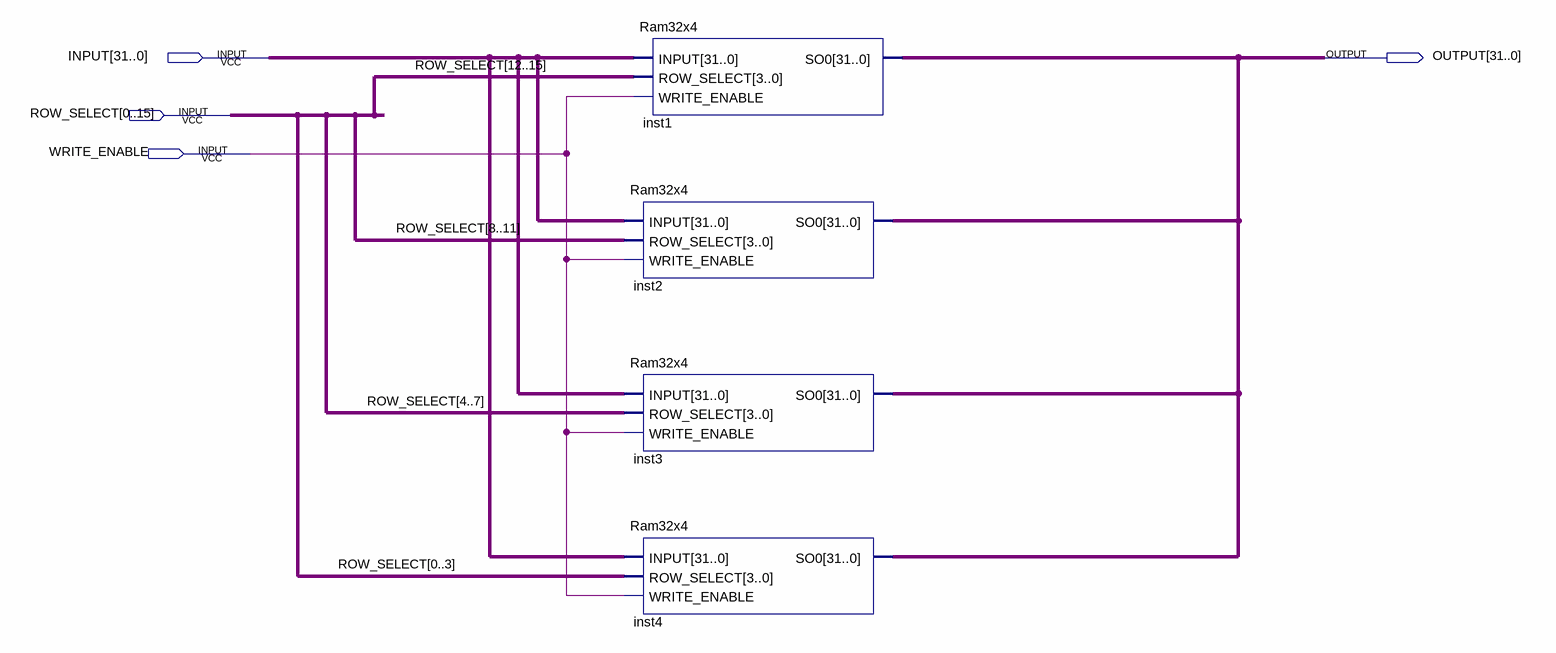
[diagram p0: schematic sheet]
// Quartus schematic Ram32x16.bdf as structural Verilog: 4 symbols, 4 pins
module Ram32x16 (
  input  [31:0] INPUT,
  input  [0:15] ROW_SELECT,
  input  WRITE_ENABLE,
  output [31:0] OUTPUT
);

  Ram32x4 inst1 (.INPUT(INPUT), .ROW_SELECT(ROW_SELECT[12:15]), .WRITE_ENABLE(WRITE_ENABLE), .SO0(OUTPUT));
  Ram32x4 inst2 (.INPUT(INPUT), .ROW_SELECT(ROW_SELECT[8:11]), .WRITE_ENABLE(WRITE_ENABLE), .SO0(OUTPUT));
  Ram32x4 inst3 (.INPUT(INPUT), .ROW_SELECT(ROW_SELECT[4:7]), .WRITE_ENABLE(WRITE_ENABLE), .SO0(OUTPUT));
  Ram32x4 inst4 (.INPUT(INPUT), .ROW_SELECT(ROW_SELECT[0:3]), .WRITE_ENABLE(WRITE_ENABLE), .SO0(OUTPUT));
endmodule
